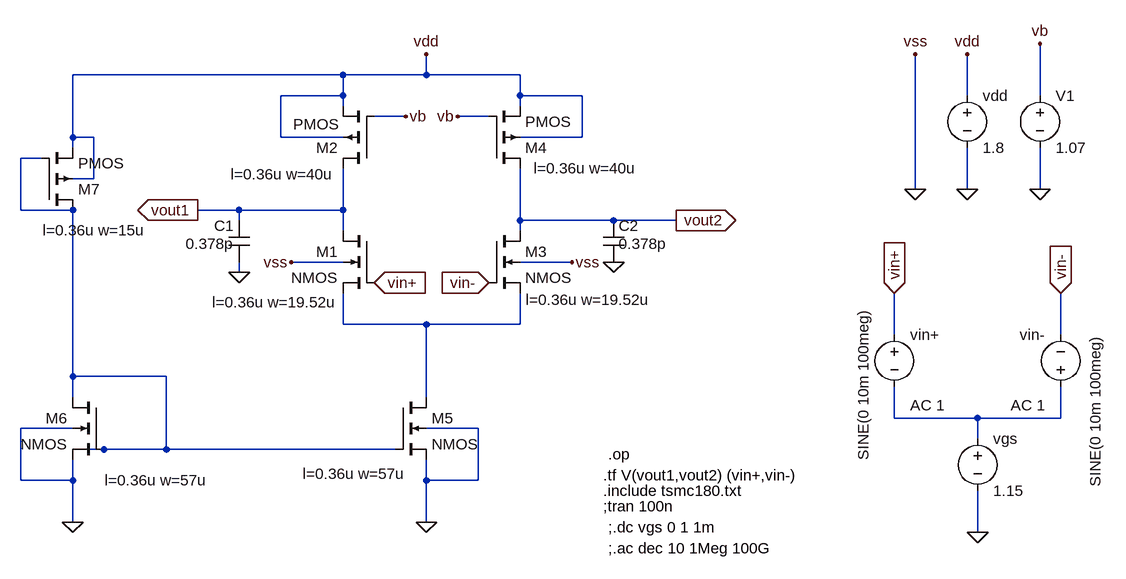
[diagram p0: schematic 1ghzdifferential pair2.asc]
1ghzdifferential pair2.asc, the LTspice schematic file:
Version 4
SHEET 1 1648 680
WIRE 256 -272 -160 -272
WIRE 384 -272 384 -304
WIRE 384 -272 256 -272
WIRE 528 -272 384 -272
WIRE 256 -240 256 -272
WIRE 256 -240 160 -240
WIRE 528 -240 528 -272
WIRE 624 -240 528 -240
WIRE 1216 -240 1216 -304
WIRE 1328 -240 1328 -320
WIRE 256 -224 256 -240
WIRE 528 -224 528 -240
WIRE 352 -208 304 -208
WIRE 480 -208 432 -208
WIRE -160 -176 -160 -272
WIRE -128 -176 -160 -176
WIRE 160 -176 160 -240
WIRE 256 -176 160 -176
WIRE 624 -176 624 -240
WIRE 624 -176 528 -176
WIRE -160 -160 -160 -176
WIRE -208 -144 -240 -144
WIRE -128 -112 -128 -176
WIRE -128 -112 -160 -112
WIRE 1136 -96 1136 -304
WIRE 1216 -96 1216 -160
WIRE 1328 -96 1328 -160
WIRE -240 -64 -240 -144
WIRE -160 -64 -240 -64
WIRE 96 -64 32 -64
WIRE 256 -64 256 -128
WIRE 256 -64 96 -64
WIRE 96 -48 96 -64
WIRE 528 -48 528 -128
WIRE 672 -48 528 -48
WIRE 768 -48 672 -48
WIRE 256 -32 256 -64
WIRE 528 -32 528 -48
WIRE 256 16 176 16
WIRE 608 16 528 16
WIRE 96 32 96 16
WIRE 256 112 256 64
WIRE 384 112 256 112
WIRE 528 112 528 64
WIRE 528 112 384 112
WIRE 1104 128 1104 64
WIRE 1360 128 1360 64
WIRE -160 192 -160 -64
WIRE -16 192 -160 192
WIRE -160 224 -160 192
WIRE 384 224 384 112
WIRE 1104 256 1104 208
WIRE 1232 256 1104 256
WIRE 1360 256 1360 208
WIRE 1360 256 1232 256
WIRE -160 272 -240 272
WIRE 464 272 384 272
WIRE 1232 288 1232 256
WIRE -112 304 -144 304
WIRE -16 304 -16 192
WIRE -16 304 -112 304
WIRE 336 304 -16 304
WIRE -240 352 -240 272
WIRE -160 352 -160 320
WIRE -160 352 -240 352
WIRE 384 352 384 320
WIRE 464 352 464 272
WIRE 464 352 384 352
WIRE -160 416 -160 352
WIRE 384 416 384 352
WIRE 1232 432 1232 368
FLAG 1216 -96 0
FLAG 1136 -96 0
FLAG 1136 -304 vss
FLAG 1216 -304 vdd
FLAG 176 16 vss
FLAG 304 48 vin+
IOPIN 304 48 In
FLAG 32 -64 vout1
IOPIN 32 -64 Out
FLAG 96 32 0
FLAG 1328 -96 0
FLAG 1328 -320 vb
FLAG 352 -208 vb
FLAG 608 16 vss
FLAG 480 48 vin-
IOPIN 480 48 In
FLAG 768 -48 vout2
IOPIN 768 -48 Out
FLAG 672 16 0
FLAG 432 -208 vb
FLAG 384 -304 vdd
FLAG 1232 432 0
FLAG 1104 64 vin+
IOPIN 1104 64 In
FLAG 1360 64 vin-
IOPIN 1360 64 In
FLAG 384 416 0
FLAG -160 416 0
DATAFLAG 256 -64 ""
DATAFLAG 528 -64 ""
DATAFLAG 528 -64 ""
DATAFLAG 256 112 ""
DATAFLAG 256 112 ""
DATAFLAG 528 112 ""
DATAFLAG 528 112 ""
DATAFLAG 64 -64 ""
DATAFLAG 736 -48 ""
DATAFLAG 736 -48 ""
DATAFLAG 0 304 ""
SYMBOL nmos4 304 -32 M0
WINDOW 123 57 110 Left 2
SYMATTR Value2 l=0.36u w=19.52u
SYMATTR InstName M1
SYMBOL voltage 1216 -256 R0
WINDOW 123 0 0 Left 0
WINDOW 39 0 0 Left 0
SYMATTR InstName vdd
SYMATTR Value 1.8
SYMBOL cap 112 -48 M0
WINDOW 3 24 36 Left 2
SYMATTR Value 0.378p
SYMATTR InstName C1
SYMBOL pmos4 304 -128 R180
WINDOW 123 62 -9 Left 2
WINDOW 3 54 68 Left 2
SYMATTR Value2 l=0.36u w=40u
SYMATTR InstName M2
SYMBOL voltage 1328 -256 R0
WINDOW 123 0 0 Left 0
WINDOW 39 0 0 Left 0
SYMATTR InstName V1
SYMATTR Value 1.07
SYMBOL nmos4 480 -32 R0
WINDOW 123 57 106 Left 2
SYMATTR Value2 l=0.36u w=19.52u
SYMATTR InstName M3
SYMBOL cap 656 -48 R0
WINDOW 3 24 36 Left 2
SYMATTR Value 0.378p
SYMATTR InstName C2
SYMBOL pmos4 480 -128 M180
WINDOW 123 69 0 Left 2
SYMATTR Value2 l=0.36u w=40u
SYMATTR InstName M4
SYMBOL voltage 1232 272 R0
WINDOW 123 0 0 Left 0
WINDOW 39 0 0 Left 0
SYMATTR InstName vgs
SYMATTR Value 1.15
SYMBOL voltage 1104 112 R0
WINDOW 3 -48 -25 VRight 2
WINDOW 123 24 124 Left 2
WINDOW 39 0 0 Left 0
SYMATTR Value SINE(0 10m 100meg)
SYMATTR Value2 AC 1
SYMATTR InstName vin+
SYMBOL voltage 1360 224 R180
WINDOW 0 24 96 Left 2
WINDOW 3 -53 -138 VRight 2
WINDOW 123 24 -12 Left 2
WINDOW 39 0 0 Left 0
SYMATTR InstName vin-
SYMATTR Value SINE(0 10m 100meg)
SYMATTR Value2 AC 1
SYMBOL nmos4 336 224 R0
WINDOW 123 -142 118 Left 2
SYMATTR Value2 l=0.36u w=57u
SYMATTR InstName M5
SYMBOL nmos4 -112 224 M0
WINDOW 123 -160 128 Left 2
SYMATTR Value2 l=0.36u w=57u
SYMATTR InstName M6
SYMBOL pmos4 -208 -64 M180
WINDOW 123 2 -31 Left 2
SYMATTR Value2 l=0.36u w=15u
SYMATTR InstName M7
TEXT 656 368 Left 2 !.include tsmc180.txt
TEXT 664 312 Left 2 !.op
TEXT 656 344 Left 2 !.tf V(vout1,vout2) (vin+,vin-)
TEXT 656 392 Left 2 !;tran 100n
TEXT 664 424 Left 2 !;.dc vgs 0 1 1m
TEXT 664 456 Left 2 !;.ac dec 10 1Meg 100G

The netlist it stands for:
* 1ghzdifferential pair2.asc
M1 vout1 vin+ N002 0 NMOS l=0.36u w=19.52u
vdd vdd 0 1.8
C1 vout1 0 0.378p
M2 vout1 vb vdd vdd PMOS l=0.36u w=40u
V1 vb 0 1.07
M3 vout2 vin- N002 0 NMOS l=0.36u w=19.52u
C2 vout2 0 0.378p
M4 vout2 vb vdd vdd PMOS l=0.36u w=40u
vgs N003 0 1.15
vin+ vin+ N003 SINE(0 10m 100meg) AC 1
vin- N003 vin- SINE(0 10m 100meg) AC 1
M5 N002 N001 0 0 NMOS l=0.36u w=57u
M6 N001 N001 0 0 NMOS l=0.36u w=57u
M7 N001 N001 vdd vdd PMOS l=0.36u w=15u
.model NMOS NMOS
.model PMOS PMOS
.lib standard.mos
.include tsmc180.txt
.op
.tf V(vout1,vout2) (vin+,vin-)
;tran 100n
;.dc vgs 0 1 1m
;.ac dec 10 1Meg 100G
.backanno
.end